# Altium schematic sheet offset.SchDoc
size A
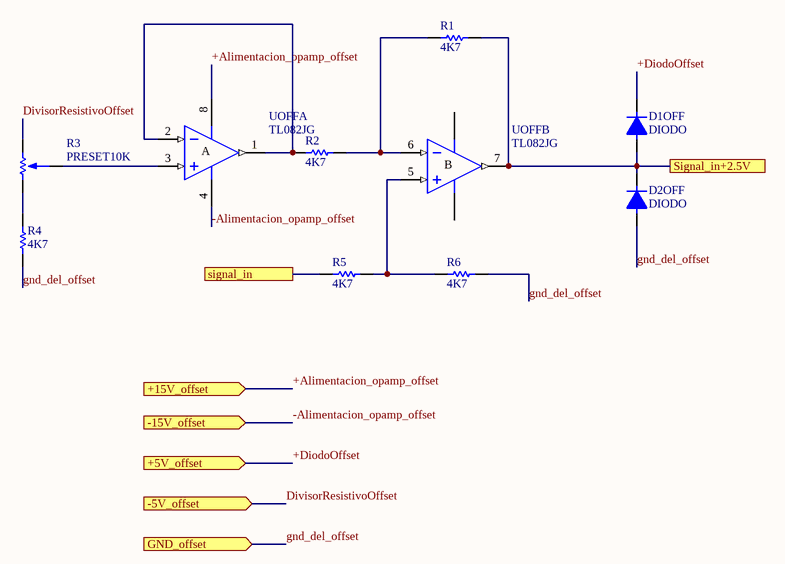
[diagram p0: offset.SchDoc]

## Parts
D1OFF  DIODO  [DO41]
D2OFF  DIODO  [DO41]
R1  4K7  [RES400]
R2  4K7  [RES400]
R3  PRESET10K  [PRESET V]
R4  4K7  [RES400]
R5  4K7  [RES400]
R6  4K7  [RES400]
UOFF  TL082JG  [JG008]  (parts A,B of 2)

## Ports
+5V_offset (in), +15V_offset (in), -5V_offset (in), -15V_offset (in), GND_offset (in), signal_in, Signal_in+2.5V

## Nets
+Alimentacion_opamp_offset: UOFF.8(V+) ; port +15V_offset
+DiodoOffset: D1OFF.2 ; port +5V_offset
-Alimentacion_opamp_offset: UOFF.4(V-) ; port -15V_offset
DivisorResistivoOffset: R3.1 ; port -5V_offset
gnd_del_offset: D2OFF.1 R4.1 R6.1 ; port GND_offset
signal_in: R5.2 ; port signal_in
Signal_in+2.5V: D1OFF.1 D2OFF.2 R1.1 UOFF.7(OUT) ; port Signal_in+2.5V
NetR1_2: R1.2 R2.1 UOFF.6(IN-)
NetR2_2: R2.2 UOFF.1(OUT) UOFF.2(IN-)
NetR3_2: R3.2 UOFF.3(IN+)
NetR3_3: R3.3 R4.2
NetR5_1: R5.1 R6.2 UOFF.5(IN+)

## Notes on the sheet
- (in symbol TL082JG, part A) A
- (in symbol TL082JG, part B) B

## Library data of the parts
R1 R2 R4-R6 = RES
R3 = PRESET
UOFF = TL082JG: JFET-Input Operational Amplifier; Published: 16-Jan-2001; LatestRevisionDate: 04-Mar-2005; LatestRevisionNote: Stylized 3D Model Added.; DatasheetVersion: Feb-1999; PackageVersion: Jan-1995; PackageReference: JG008; Publisher: Altium Limited; PackageDescription: DIP; 8 Leads; Row Spacing 7.62 mm; Pitch 2.54 mm; ComponentLink1Description: Manufacturer Link; ComponentLink1URL: http://www.ti.com/; ComponentLink2Description: Datasheet; ComponentLink2URL: http://www-s.ti.com/sc/ds/tl082.pdf